# EAGLE schematic REVAr-HW_v0.0 (EAGLE 9.1.0)

## Sheet 1 of 2
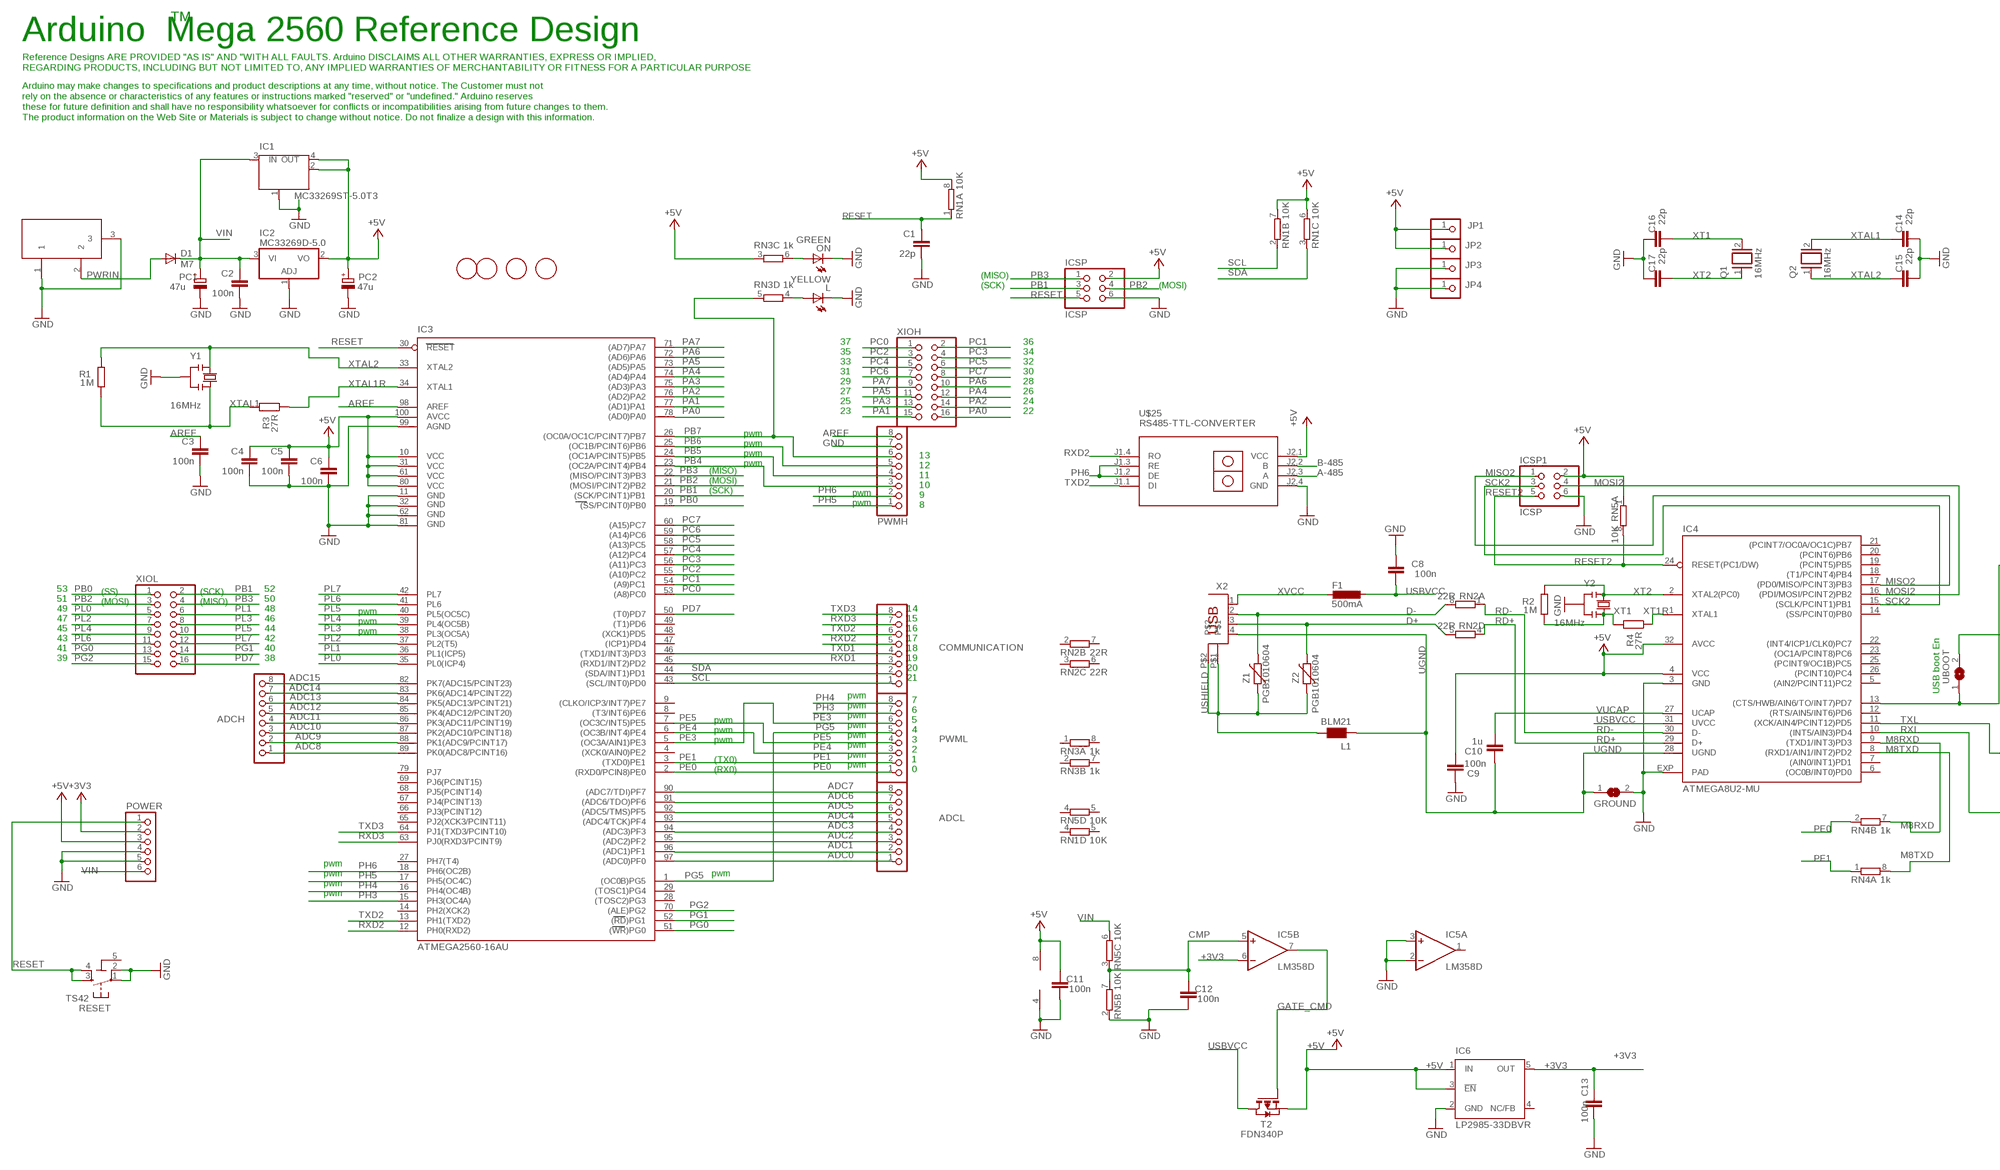
[diagram p0: schematic, sheet 1, part 1 of 2]
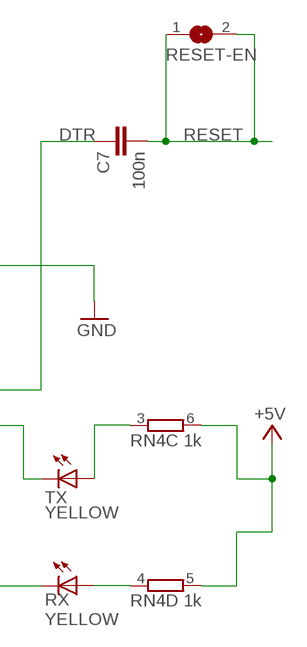
[diagram p1: schematic, sheet 1, part 2 of 2]

### Parts
ADCH  PINHD-1X8  [1X08]
ADCL  PINHD-1X8  [1X08]
C1  22p  C-EU0603-RND  [C0603-ROUND]
C2  100n  C-EU0603-RND  [C0603-ROUND]
C3  100n  C-EU0603-RND  [C0603-ROUND]
C4  100n  C-EU0603-RND  [C0603-ROUND]
C5  100n  C-EU0603-RND  [C0603-ROUND]
C6  100n  C-EU0603-RND  [C0603-ROUND]
C7  100n  C-EU0603-RND  [C0603-ROUND]
C8  100n  C-EUC0603  [C0603]
C9  100n  C-EU0603-RND  [C0603-ROUND]
C10  1u  C-EU0603-RND  [C0603-ROUND]
C11  100n  C-EUC0603  [C0603]
C12  100n  C-EU0603-RND  [C0603-ROUND]
C13  100n  C-EU0603-RND  [C0603-ROUND]
C14  22p  C-EU0603-RND  [C0603-ROUND]
C15  22p  C-EU0603-RND  [C0603-ROUND]
C16  22p  C-EU0603-RND  [C0603-ROUND]
C17  22p  C-EU0603-RND  [C0603-ROUND]
COMMUNICATION  PINHD-1X8  [1X08]
D1  M7  DIODE-SMB  [SMB]
F1  500mA  L-EUL1812  [L1812]
GROUND  SJ  [SJ]
IC1  MC33269ST-5.0T3  MC33269ST-3.3T3  [SOT223]
IC2  MC33269D-5.0  [DPACK]
IC3  ATMEGA2560-16AU  ATMEGA1280-16AU  [TQFP100]
IC4  ATMEGA8U2-MU  [QFN32]
IC5  LM358D  [SO08]
IC6  LP2985-33DBVR  TPS77033  [SOT23-DBV]
ICSP  ICSP  PINHD-2X3  [2X03]
ICSP1  ICSP  PINHD-2X3  [2X03]
JP1  PINHD-1X1  [1X01]
JP2  PINHD-1X1  [1X01]
JP3  PINHD-1X1  [1X01]
JP4  PINHD-1X1  [1X01]
L  YELLOW  LEDCHIP-LED0805  [CHIP-LED0805]
L1  BLM21  WE-CBF_0805  [0805]
ON  GREEN  LEDCHIP-LED0805  [CHIP-LED0805]
PC1  47u  CPOL-EUD  [PANASONIC_D]
PC2  47u  CPOL-EUD  [PANASONIC_D]
POWER  PINHD-1X6  [1X06]
PWMH  PINHD-1X8  [1X08]
PWML  PINHD-1X8  [1X08]
Q1  16MHz  XTAL/S  [QS]
Q2  16MHz  XTAL/S  [QS]
R1  1M  R-EU_R0603  [R0603-ROUND]
R2  1M  R-EU_R0603  [R0603-ROUND]
R3  27R  R-EU_R0603  [R0603-ROUND]
R4  27R  R-EU_R0603  [R0603-ROUND]
RESET  TS42  [TS42]
RESET-EN  SJ  [SJ]
RN1  10K  4R-NCAT16  [CAT16]
RN2  22R  4R-NCAY16  [CAY16]
RN3  1k  4R-NCAY16  [CAY16]
RN4  1k  4R-NCAY16  [CAY16]
RN5  10K  4R-NCAT16  [CAT16]
RX  YELLOW  LEDCHIP-LED0805  [CHIP-LED0805]
T2  FDN340P  PMOSSOT23  [SOT-23]
TX  YELLOW  LEDCHIP-LED0805  [CHIP-LED0805]
U$2  FIDUCIALMOUNT  [FIDUCIA-MOUNT]
U$3  FIDUCIALMOUNT  [FIDUCIA-MOUNT]
U$4  FIDUCIALMOUNT  [FIDUCIA-MOUNT]
U$5  FIDUCIALMOUNT  [FIDUCIA-MOUNT]
U$25  RS485-TTL-CONVERTER  [RS485-TTL-CONVERTER]
UBOOT  SJ  [SJ]
X1  DC21MMX  [DC-21MM]
X2  PN61729  [PN61729]
XIOH  PINHD-2X8  [2X08]
XIOL  PINHD-2X8  [2X08]
Y1  16MHz  RESONATORMU  [RESONATOR]
Y2  16MHz  RESONATORMU  [RESONATOR]
Z1  PGB1010604  VARISTORCN0603  [CT/CN0603]
Z2  PGB1010604  VARISTORCN0603  [CT/CN0603]

### Nets
+3V3: C13.2 IC5.6(B:-IN) IC6.5(OUT) POWER.2
+5V: C4.1 C5.1 C6.1 C9.1 C11.2 IC1.2(OUT) IC1.4(OUT) IC2.2(VO) IC3.10(VCC) IC3.31(VCC1) IC3.61(VCC2) IC3.80(VCC3) IC3.100(AVCC) IC4.4(VCC) IC4.32(AVCC) IC5.8(P:V+) IC6.1(IN) IC6.3(!EN) ICSP1.2 ICSP.2 JP1.1 JP2.1 PC2.+ POWER.3 RN1.6 RN1.7 RN1.8 RN3.3 RN4.5 RN4.6 RN5.1 T2.2(S) ; also sheet 2
A-485: U$25.J2.3(A) ; also sheet 2
ADC0: ADCL.1 IC3.97((ADC0)PF0)
ADC1: ADCL.2 IC3.96((ADC1)PF1)
ADC2: ADCL.3 IC3.95((ADC2)PF2)
ADC3: ADCL.4 IC3.94((ADC3)PF3)
ADC4: ADCL.5 IC3.93((ADC4/TCK)PF4)
ADC5: ADCL.6 IC3.92((ADC5/TMS)PF5)
ADC6: ADCL.7 IC3.91((ADC6/TDO)PF6)
ADC7: ADCL.8 IC3.90((ADC7/TDI)PF7)
ADC8: ADCH.1 IC3.89(PK0(ADC8/PCINT16))
ADC9: ADCH.2 IC3.88(PK1(ADC9/PCINT17))
ADC10: ADCH.3 IC3.87(PK2(ADC10/PCINT18))
ADC11: ADCH.4 IC3.86(PK3(ADC11/PCINT19))
ADC12: ADCH.5 IC3.85(PK4(ADC12/PCINT20))
ADC13: ADCH.6 IC3.84(PK5(ADC13/PCINT21))
ADC14: ADCH.7 IC3.83(PK6(ADC14/PCINT22))
ADC15: ADCH.8 IC3.82(PK7(ADC15/PCINT23))
AREF: C3.1 IC3.98(AREF) PWMH.8
B-485: U$25.J2.2(B) ; also sheet 2
CMP: C12.2 IC5.5(B:+IN) RN5.3 RN5.7
D+: RN2.5 X2.3 Z2.2
D-: RN2.8 X2.2 Z1.2
DTR: C7.1 IC4.13((CTS/HWB/AIN6/TO/INT7)PD7) UBOOT.1
GATE_CMD: IC5.7(B:OUT) T2.3(G)
GND: C1.2 C2.2 C3.2 C4.2 C5.2 C6.2 C8.2 C9.2 C11.1 C12.1 C13.1 C14.1 C15.1 C16.2 C17.2 GROUND.2 IC1.1(GND/ADJ) IC2.1(ADJ) IC3.11(GND) IC3.32(GND1) IC3.62(GND2) IC3.81(GND3) IC3.99(AGND) IC4.3(GND) IC4.EXP(PAD) IC5.2(A:-IN) IC5.3(A:+IN) IC5.4(P:V-) IC6.2(GND) ICSP1.6 ICSP.6 JP3.1 JP4.1 L.C ON.C PC1.- PC2.- POWER.4 POWER.5 PWMH.7 RESET.1 RESET.2 RN5.2 U$25.J2.4(GND) UBOOT.2 X1.1 X1.3 Y1.2 Y2.2 ; also sheet 2
M8RXD: IC4.9((TXD1/INT3)PD3) RN4.7
M8TXD: IC4.8((RXD1/AIN1/INT2)PD2) RN4.8
MISO2: IC4.17((PD0/MISO/PCINT3)PB3) ICSP1.1
MOSI2: IC4.16((PDI/MOSI/PCINT2)PB2) ICSP1.4
N$2: L.A RN3.4
N$3: ON.A RN3.6
N$54: RN4.4 RX.A
N$55: RN4.3 TX.A
PA0: IC3.78((AD0)PA0) XIOH.16
PA1: IC3.77((AD1)PA1) XIOH.15
PA2: IC3.76((AD2)PA2) XIOH.14
PA3: IC3.75((AD3)PA3) XIOH.13
PA4: IC3.74((AD4)PA4) XIOH.12
PA5: IC3.73((AD5)PA5) XIOH.11
PA6: IC3.72((AD6)PA6) XIOH.10
PA7: IC3.71((AD7)PA7) XIOH.9
PB0: IC3.19((SS/PCINT0)PB0) XIOL.1
PB1: IC3.20((SCK/PCINT1)PB1) ICSP.3 XIOL.2 ; also sheet 2
PB2: IC3.21((MOSI/PCINT2)PB2) ICSP.4 XIOL.3 ; also sheet 2
PB3: IC3.22((MISO/PCINT3)PB3) ICSP.1 XIOL.4 ; also sheet 2
PB4: IC3.23((OC2A/PCINT4)PB4) PWMH.3 ; also sheet 2
PB5: IC3.24((OC1A/PCINT5)PB5) PWMH.4 ; also sheet 2
PB6: IC3.25((OC1B/PCINT6)PB6) PWMH.5 ; also sheet 2
PB7: IC3.26((OC0A/OC1C/PCINT7)PB7) PWMH.6 RN3.5 ; also sheet 2
PC0: IC3.53((A8)PC0) XIOH.1
PC1: IC3.54((A9)PC1) XIOH.2
PC2: IC3.55((A10)PC2) XIOH.3
PC3: IC3.56((A11)PC3) XIOH.4
PC4: IC3.57((A12)PC4) XIOH.5
PC5: IC3.58((A13)PC5) XIOH.6
PC6: IC3.59((A14)PC6) XIOH.7
PC7: IC3.60((A15)PC7) XIOH.8
PD7: IC3.50((T0)PD7) XIOL.16
PE0: IC3.2((RXD0/PCIN8)PE0) PWML.1 RN4.2
PE1: IC3.3((TXD0)PE1) PWML.2 RN4.1
PE3: IC3.5((OC3A/AIN1)PE3) PWML.6 ; also sheet 2
PE4: IC3.6((OC3B/INT4)PE4) PWML.3 ; also sheet 2
PE5: IC3.7((OC3C/INT5)PE5) PWML.4 ; also sheet 2
PG0: IC3.51((WR)PG0) XIOL.13
PG1: IC3.52((RD)PG1) XIOL.14
PG2: IC3.70((ALE)PG2) XIOL.15
PG5: IC3.1((OC0B)PG5) PWML.5 ; also sheet 2
PH3: IC3.15(PH3(OC4A)) PWML.7 ; also sheet 2
PH4: IC3.16(PH4(OC4B)) PWML.8 ; also sheet 2
PH5: IC3.17(PH5(OC4C)) PWMH.1 ; also sheet 2
PH6: IC3.18(PH6(OC2B)) PWMH.2 U$25.J1.2(DE) U$25.J1.3(RE)
PL0: IC3.35(PL0(ICP4)) XIOL.5
PL1: IC3.36(PL1(ICP5)) XIOL.6
PL2: IC3.37(PL2(T5)) XIOL.7
PL3: IC3.38(PL3(OC5A)) XIOL.8
PL4: IC3.39(PL4(OC5B)) XIOL.9
PL5: IC3.40(PL5(OC5C)) XIOL.10
PL6: IC3.41(PL6) XIOL.11
PL7: IC3.42(PL7) XIOL.12
PWRIN: D1.A X1.2
RD+: IC4.29(D+) RN2.4
RD-: IC4.30(D-) RN2.1
RESET: C1.1 C7.2 IC3.30(RESET) ICSP.5 POWER.1 RESET-EN.1 RESET-EN.2 RESET.3 RESET.4 RN1.1
RESET2: IC4.24(RESET(PC1/DW)) ICSP1.5 RN5.8
RXD1: COMMUNICATION.3 IC3.45((RXD1/INT2)PD2) ; also sheet 2
RXD2: COMMUNICATION.5 IC3.12(PH0(RXD2)) U$25.J1.4(RO)
RXD3: COMMUNICATION.7 IC3.63(PJ0(RXD3/PCINT9))
RXL: IC4.10((INT5/AIN3)PD4) RX.C
SCK2: IC4.15((SCLK/PCINT1)PB1) ICSP1.3
SCL: COMMUNICATION.1 IC3.43((SCL/INT0)PD0) RN1.2 ; also sheet 2
SDA: COMMUNICATION.2 IC3.44((SDA/INT1)PD1) RN1.3 ; also sheet 2
TXD1: COMMUNICATION.4 IC3.46((TXD1/INT3)PD3) ; also sheet 2
TXD2: COMMUNICATION.6 IC3.13(PH1(TXD2)) U$25.J1.1(DI)
TXD3: COMMUNICATION.8 IC3.64(PJ1(TXD3/PCINT10))
TXL: IC4.11((XCK/AIN4/PCINT12)PD5) TX.C
UGND: C10.2 GROUND.1 IC4.28(UGND) L1.1 X2.4
USBVCC: C8.1 F1.1 IC4.31(UVCC) T2.1(D)
USHIELD: L1.2 X2.P$1 X2.P$2 Z1.1 Z2.1
VCC: U$25.J2.1(VCC) ; supply symbol labelled +5V ; also sheet 2
VIN: C2.1 D1.C IC1.3(IN) IC2.3(VI) PC1.+ POWER.6 RN5.6
VUCAP: C10.1 IC4.27(UCAP)
XT1: C16.1 Q1.2 R2.1 R4.2 Y2.3
XT1R: IC4.1(XTAL1) R4.1
XT2: C17.1 IC4.2(XTAL2(PC0)) Q1.1 R2.2 Y2.1
XTAL1: C14.2 Q2.2 R1.1 R3.2 Y1.3
XTAL1R: IC3.34(XTAL1) R3.1
XTAL2: C15.2 IC3.33(XTAL2) Q2.1 R1.2 Y1.1
XVCC: F1.2 X2.1
Unconnected: IC3.4((XCK0/AIN0)PE2) IC3.8((T3/INT6)PE6) IC3.9((CLKO/ICP3/INT7)PE7) IC3.14(PH2(XCK2)) IC3.27(PH7(T4)) IC3.28((TOSC2)PG3) IC3.29((TOSC1)PG4) IC3.47((ICP1)PD4) IC3.48((XCK1)PD5) IC3.49((T1)PD6) IC3.65(PJ2(XCK3/PCINT11)) IC3.66(PJ3(PCINT12)) IC3.67(PJ4(PCINT13)) IC3.68(PJ5(PCINT14)) IC3.69(PJ6(PCINT15)) IC3.79(PJ7) IC4.5((AIN2/PCINT11)PC2) IC4.6((OC0B/INT0)PD0) IC4.7((AIN0/INT1)PD1) IC4.12((RTS/AIN5/INT6)PD6) IC4.14((SS/PCINT0)PB0) IC4.18((T1/PCINT4)PB4) IC4.19((PCINT5)PB5) IC4.20((PCINT6)PB6) IC4.21((PCINT7/OC0A/OC1C)PB7) IC4.22((INT4/ICP1/CLK0)PC7) IC4.23((OC1A/PCINT8)PC6) IC4.25((PCINT9/OC1B)PC5) IC4.26((PCINT10)PC4) IC5.1(A:OUT) IC6.4(NC/FB) RN1.4 RN1.5 RN2.2 RN2.3 RN2.6 RN2.7 RN3.1 RN3.2 RN3.7 RN3.8 RN5.4 RN5.5

### Notes on the sheet
- TM
- Arduino  Mega 2560 Reference Design
- Reference Designs ARE PROVIDED "AS IS" AND "WITH ALL FAULTS. Arduino DISCLAIMS ALL OTHER WARRANTIES, EXPRESS OR IMPLIED,
  REGARDING PRODUCTS, INCLUDING BUT NOT LIMITED TO, ANY IMPLIED WARRANTIES OF MERCHANTABILITY OR FITNESS FOR A PARTICULAR PURPOSE
- Arduino may make changes to specifications and product descriptions at any time, without notice. The Customer must not
  rely on the absence or characteristics of any features or instructions marked "reserved" or "undefined." Arduino reserves
  these for future definition and shall have no responsibility whatsoever for conflicts or incompatibilities arising from future changes to them.
  The product information on the Web Site or Materials is subject to change without notice. Do not finalize a design with this information.
- (MISO)
- (SCK) | (MOSI)
- 37 | 36
- 35 | 34
- 33 | 32
- 31 | 30
- 29 | 28
- 27 | 26
- 25 | 24
- 23 | 22
- pwm
- pwm
- pwm | 13
- pwm | 12
- (MISO)
- 11
- (MOSI)
- 10
- (SCK) | pwm
- 9
- pwm | 8
- 53 | (SS) | (SCK) | 52
- 51 | (MOSI) | (MISO) | 50
- 49 | 48 | pwm | 14
- 47 | 46 | pwm | 15
- 45 | 44 | pwm | 16
- 43 | 42 | 17
- 41 | 40 | 18
- 39 | 38 | 19
- 20
- 21
- USB boot En
- pwm
- 7
- pwm
- 6
- pwm
- pwm | 5
- pwm
- pwm | 4
- pwm
- pwm | 3
- pwm
- 2
- pwm
- (TX0) | 1
- pwm
- (RX0) | 0
- pwm
- pwm | pwm
- pwm
- pwm

## Sheet 2 of 2
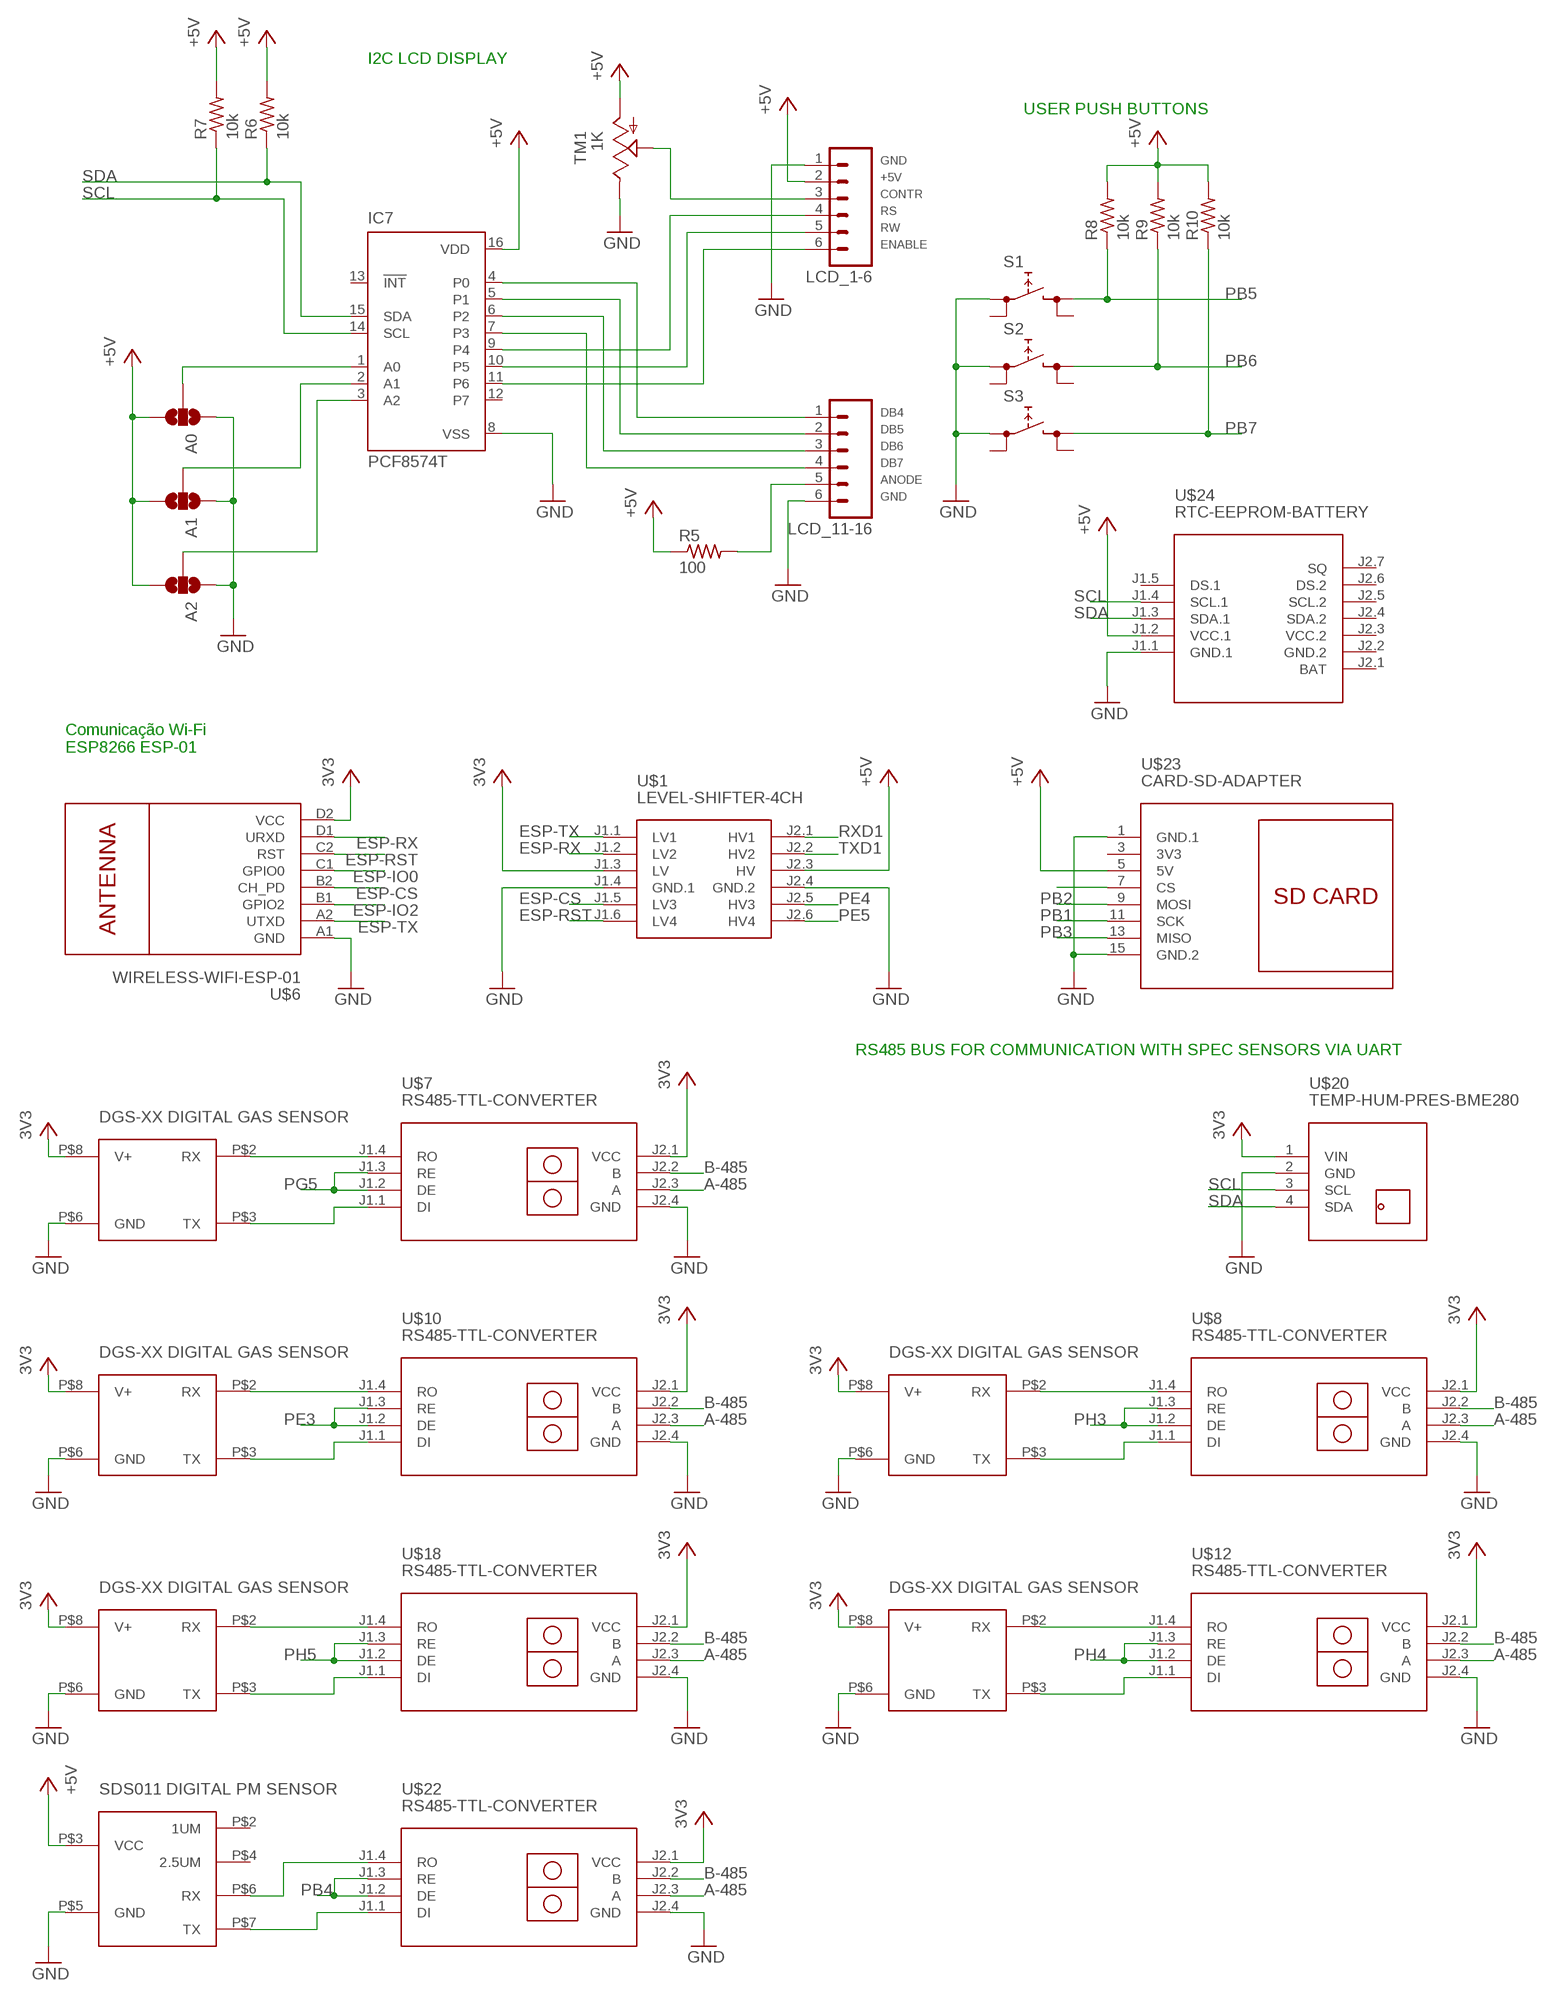
[diagram p2: schematic, sheet 2]

### Parts
A0  SOLDERJUMPER_2WAYT  [SJ_2]
A1  SOLDERJUMPER_2WAYT  [SJ_2]
A2  SOLDERJUMPER_2WAYT  [SJ_2]
IC7  PCF8574T  [SO16W]
LCD_1-6  M06SIP  [1X06]
LCD_11-16  M06SIP  [1X06]
R5  100  R-US_R0805  [R0805]
R6  10k  R-US_R0805  [R0805]
R7  10k  R-US_R0805  [R0805]
R8  10k  R-US_R0805  [R0805]
R9  10k  R-US_R0805  [R0805]
R10  10k  R-US_R0805  [R0805]
S1  REKN  [REKN]
S2  REKN  [REKN]
S3  REKN  [REKN]
TM1  1K  TRIM  [6MM]
U$1  LEVEL-SHIFTER-4CH  [LEVEL-SHIFTER-4CH]
U$6  WIRELESS-WIFI-ESP-01  [WIRELESS-WIFI-ESP-01]
U$7  RS485-TTL-CONVERTER  [RS485-TTL-CONVERTER]
U$8  RS485-TTL-CONVERTER  [RS485-TTL-CONVERTER]
U$9  DGS-XX  [DGS-XX]
U$10  RS485-TTL-CONVERTER  [RS485-TTL-CONVERTER]
U$11  DGS-XX  [DGS-XX]
U$12  RS485-TTL-CONVERTER  [RS485-TTL-CONVERTER]
U$16  DGS-XX  [DGS-XX]
U$17  DGS-XX  [DGS-XX]
U$18  RS485-TTL-CONVERTER  [RS485-TTL-CONVERTER]
U$19  DGS-XX  [DGS-XX]
U$20  TEMP-HUM-PRES-BME280  [TEMP-HUM-PRES-BME280]
U$21  SDS011  [SDS011]
U$22  RS485-TTL-CONVERTER  [RS485-TTL-CONVERTER]
U$23  CARD-SD-ADAPTER  [CARD-SD-ADAPTER]
U$24  RTC-EEPROM-BATTERY  [RTC-EEPROM-BATTERY]

### Nets
+5V: LCD_1-6.2 ; also sheet 1
A0: A0.2 IC7.1(A0)
A1: A1.2 IC7.2(A1)
A2: A2.2 IC7.3(A2)
A-485: U$7.J2.3(A) U$8.J2.3(A) U$10.J2.3(A) U$12.J2.3(A) U$18.J2.3(A) U$22.J2.3(A) ; also sheet 1
ANODE: LCD_11-16.5 R5.2
B-485: U$7.J2.2(B) U$8.J2.2(B) U$10.J2.2(B) U$12.J2.2(B) U$18.J2.2(B) U$22.J2.2(B) ; also sheet 1
CONTR: LCD_1-6.3 TM1.S
DB4: IC7.4(P0) LCD_11-16.1
DB5: IC7.5(P1) LCD_11-16.2
DB6: IC7.6(P2) LCD_11-16.3
DB7: IC7.7(P3) LCD_11-16.4
ENABLE: IC7.11(P6) LCD_1-6.6
ESP-CS: U$1.J1.5(LV3) U$6.B2(CH_PD)
ESP-IO0: U$6.C1(GPIO0)
ESP-IO2: U$6.B1(GPIO2)
ESP-RST: U$1.J1.6(LV4) U$6.C2(RST)
ESP-RX: U$1.J1.2(LV2) U$6.D1(URXD)
ESP-TX: U$1.J1.1(LV1) U$6.A2(UTXD)
GND: A0.1 A1.1 A2.1 IC7.8(VSS) LCD_1-6.1 LCD_11-16.6 S1.0A S2.0A S3.0A TM1.E U$1.J1.4(GND.1) U$1.J2.4(GND.2) U$6.A1(GND) U$7.J2.4(GND) U$8.J2.4(GND) U$9.P$6(GND) U$10.J2.4(GND) U$11.P$6(GND) U$12.J2.4(GND) U$16.P$6(GND) U$17.P$6(GND) U$18.J2.4(GND) U$19.P$6(GND) U$20.2(GND) U$21.P$5(GND) U$22.J2.4(GND) U$23.1(GND.1) U$23.15(GND.2) U$24.J1.1(GND.1) ; also sheet 1
N$1: U$7.J1.4(RO) U$16.P$2(RX)
N$4: U$7.J1.1(DI) U$16.P$3(TX)
N$5: U$10.J1.4(RO) U$11.P$2(RX)
N$6: U$10.J1.1(DI) U$11.P$3(TX)
N$7: U$18.J1.4(RO) U$19.P$2(RX)
N$8: U$8.J1.1(DI) U$9.P$3(TX)
N$9: U$18.J1.1(DI) U$19.P$3(TX)
N$10: U$12.J1.4(RO) U$17.P$2(RX)
N$11: U$8.J1.4(RO) U$9.P$2(RX)
N$12: U$12.J1.1(DI) U$17.P$3(TX)
N$13: U$21.P$6(RX) U$22.J1.4(RO)
N$14: U$21.P$7(TX) U$22.J1.1(DI)
N$18: U$23.7(CS)
PB1: U$23.11(SCK) ; also sheet 1
PB2: U$23.9(MOSI) ; also sheet 1
PB3: U$23.13(MISO) ; also sheet 1
PB4: U$22.J1.2(DE) U$22.J1.3(RE) ; also sheet 1
PB5: R8.1 S1.1A ; also sheet 1
PB6: R9.1 S2.1A ; also sheet 1
PB7: R10.1 S3.1A ; also sheet 1
PE3: U$10.J1.2(DE) U$10.J1.3(RE) ; also sheet 1
PE4: U$1.J2.5(HV3) ; also sheet 1
PE5: U$1.J2.6(HV4) ; also sheet 1
PG5: U$7.J1.2(DE) U$7.J1.3(RE) ; also sheet 1
PH3: U$8.J1.2(DE) U$8.J1.3(RE) ; also sheet 1
PH4: U$12.J1.2(DE) U$12.J1.3(RE) ; also sheet 1
PH5: U$18.J1.2(DE) U$18.J1.3(RE) ; also sheet 1
RS: IC7.9(P4) LCD_1-6.4
RW: IC7.10(P5) LCD_1-6.5
RXD1: U$1.J2.1(HV1) ; also sheet 1
SCL: IC7.14(SCL) R7.1 U$20.3(SCL) U$24.J1.4(SCL.1) ; also sheet 1
SDA: IC7.15(SDA) R6.1 U$20.4(SDA) U$24.J1.3(SDA.1) ; also sheet 1
TXD1: U$1.J2.2(HV2) ; also sheet 1
VCC: A0.3 A1.3 A2.3 IC7.16(VDD) R5.1 R6.2 R7.2 R8.2 R9.2 R10.2 TM1.A U$1.J1.3(LV) U$1.J2.3(HV) U$6.D2(VCC) U$7.J2.1(VCC) U$8.J2.1(VCC) U$9.P$8(V+) U$10.J2.1(VCC) U$11.P$8(V+) U$12.J2.1(VCC) U$16.P$8(V+) U$17.P$8(V+) U$18.J2.1(VCC) U$19.P$8(V+) U$20.1(VIN) U$21.P$3(VCC) U$22.J2.1(VCC) U$23.5(5V) U$24.J1.2(VCC.1) ; supply symbol labelled 3V3, +5V ; also sheet 1
Unconnected: IC7.12(P7) IC7.13(!INT) S1.0B S1.1B S2.0B S2.1B S3.0B S3.1B U$21.P$2(1UM) U$21.P$4(2.5UM) U$24.J1.5(DS.1) U$24.J2.1(BAT) U$24.J2.4(SDA.2) U$24.J2.5(SCL.2) U$24.J2.6(DS.2) U$24.J2.7(SQ)

### Notes on the sheet
- I2C LCD DISPLAY
- USER PUSH BUTTONS
- Comunicação Wi-Fi
  ESP8266 ESP-01
- RS485 BUS FOR COMMUNICATION WITH SPEC SENSORS VIA UART

## Power pins joined to a net without a drawn wire
3V3: U$23.3(3V3)
5-GND: RESET.5(5-GND)
GND.2: U$24.J2.2(GND.2)
VCC.2: U$24.J2.3(VCC.2)

## Library data of the parts
A0 A1 A2 = SparkFun:SOLDERJUMPER_2WAY: Solder Jumper 2 way solder jumper
ADCH ADCL COMMUNICATION PWMH PWML = pinhead:PINHD-1X8: PIN HEADER
C1-C7 C9 C10 C12-C17 = SmartPrj:C-EU: CAPACITOR, European symbol
C8 C11 = rcl:C-EU: CAPACITOR, European symbol
D1 = diode:DIODE-: DIODE
F1 = rcl:L-EU: INDUCTOR, European symbol
GROUND RESET-EN UBOOT = jumper:SJ: SMD solder JUMPER
IC1 = linear:MC33269ST*: Adjustable Output Low Dropout Voltage Regulator 800 mA Source: http://www.onsemi.com/pub/Collateral/MC33269-D.PDF
IC2 = linear:MC33269?*: Adjustable Output Low Dropout Voltage Regulator 800 mA Source: http://www.onsemi.com/pub/Collateral/MC33269-D.PDF
IC3 = atmel-2005:ATMEGA*: MICROCONTROLLER 64/128/256 Kbytes FLASH 4 Kbytes EEPROM 8 Kbytes SRAM 86 General Purpose I/O pins 12-channels16-bit PWM 4 x Serial USARTs 16-channels 10-bit A/D
IC4 = atmel:ATMEGA8U2-MU
IC5 = linear:LM358: OP AMP also LM158; LM258; LM2904 Source: http://cache.national.com/ds/LM/LM158.pdf
IC6 = texas:TPS770*: ULTRALOW-POWER 50-mA LOW-DROPOUT LINEAR REGULATORS 50-mA Low-Dropout Regulator Source: http://focus.ti.com/lit/ds/symlink/tps77001.pdf
IC7 = micro-philips:PCF8574: I2C-Bus Remote 8-bit I/O expander http://www.semiconductors.philips.com/acrobat_download/datasheets/PCF8574_4.pdf; MPN: PCF8574T/3,512; OC_FARNELL: 1201255; OC_NEWARK: 70R6870
ICSP ICSP1 = pinhead:PINHD-2X3: PIN HEADER
JP1-JP4 = pinhead:PINHD-1X1: PIN HEADER
L ON RX TX = led:LED: LED OSRAM: - CHIPLED LG R971, LG N971, LY N971, LG Q971, LY Q971, LO R971, LY R971 LH N974, LH R974 LS Q976, LO Q976, LY Q976 LO Q996 - Hyper CHIPLED LW Q18S LB Q993, LB Q99A, LB R99A - SideLED LS A670, LO A670, LY A670, LG A670, LP A670 LB A673, LV A673, LT A673, LW A673 LH A674 LY A675 LS A676, LA A676, LO A676, LY A676, LW A676 LS A679, LY A679, LG A679 - Hyper Micro SIDELED® LS Y876, LA Y876, LO Y876, LY Y876 LT Y87S - SmartLED LW L88C, LW L88S LB L89C, LB L89S, LG L890 LS L89K, LO L89K, LY L89K LS L896, LA L896, LO L896, LY L896 - TOPLED LS T670, LO T670, LY T670, LG T670, LP T670 LSG T670, LSP T670, LSY T670, LOP T670, LYG T670 LG T671, LOG T671, LSG T671 LB T673, LV T673, LT T673, LW T673 LH T674 LS T676, LA T676, LO T676, LY T676, LB T676, LH T676, LSB T676, LW T676 LB T67C, LV T67C, LT T67C, LS T67K, LO T67K, LY T67K, LW E67C LS E67B, LA E67B, LO E67B, LY E67B, LB E67C, LV E67C, LT E67C LW T67C LS T679, LY T679, LG T679 LS T770, LO T770, LY T770, LG T770, LP T770 LB T773, LV T773, LT T773, LW T773 LH T774 LS E675, LA E675, LY E675, LS T675 LS T776, LA T776, LO T776, LY T776, LB T776 LHGB T686 LT T68C, LB T68C - Hyper Mini TOPLED® LB M676 - Mini TOPLED Santana® LG M470 LS M47K, LO M47K, LY M47K Source: http://www.osram.convergy.de LUXEON: - LUMILED® LXK2-PW12-R00, LXK2-PW12-S00, LXK2-PW14-U00, LXK2-PW14-V00 LXK2-PM12-R00, LXK2-PM12-S00, LXK2-PM14-U00 LXK2-PE12-Q00, LXK2-PE12-R00, LXK2-PE12-S00, LXK2-PE14-T00, LXK2-PE14-U00 LXK2-PB12-K00, LXK2-PB12-L00, LXK2-PB12-M00, LXK2-PB14-N00, LXK2-PB14-P00, LXK2-PB14-Q00 LXK2-PR12-L00, LXK2-PR12-M00, LXK2-PR14-Q00, LXK2-PR14-R00 LXK2-PD12-Q00, LXK2-PD12-R00, LXK2-PD12-S00 LXK2-PH12-R00, LXK2-PH12-S00 LXK2-PL12-P00, LXK2-PL12-Q00, LXK2-PL12-R00 Source: www.luxeon.com KINGBRIGHT: KA-3528ASYC Source: www.kingbright.com
L1 = wuerth-elektronik:WE-CBF: SMD EMI Suppression Ferrite Beads - excellent anti-EMI properties - low DCR - impedances till 3000 ohms - rated current up to 6 A
LCD_1-6 LCD_11-16 = SparkFun-Connectors:M06: Header 6 Standard 6-pin 0.1" header. Use with straight break away headers (SKU : PRT-00116), right angle break away headers (PRT-00553), swiss pins (PRT-00743), machine pins (PRT-00117), and female headers (PRT-00115). Molex polarized connector foot print use with SKU : PRT-08094 with associated crimp pins and housings. NOTES ON THE VARIANTS LOCK and LOCK_LONGPADS... This footprint was designed to help hold the alignment of a through-hole component (i.e. 6-pin header) while soldering it into place. You may notice that each hole has been shifted either up or down by 0.005 of an inch from it's more standard position (which is a perfectly straight line). This slight alteration caused the pins (the squares in the middle) to touch the edges of the holes. Because they are alternating, it causes a "brace" to hold the component in place. 0.005 has proven to be the perfect amount of "off-center" position when using our standard breakaway headers. Although looks a little odd when you look at the bare footprint, once you have a header in there, the alteration is very hard to notice. Also, if you push a header all the way into place, it is covered up entirely on the bottom side. This idea of altering the position of holes to aid alignment will be further integrated into the Sparkfun Library for other footprints. It can help hold any component with 3 or more connection pins.
PC1 PC2 = rcl:CPOL-EU: POLARIZED CAPACITOR, European symbol
POWER = pinhead:PINHD-1X6: PIN HEADER
Q1 Q2 = special:XTAL/S: CRYSTAL
R1-R4 = SmartPrj:R-EU_: RESISTOR, European symbol
R5-R10 = adafruit:R-US_: RESISTOR, American symbol
RESET = st-mod v1.4:TS42: TS42 Dongnan Electronics Tact switch VDC 12V - 50mA
RN1-RN5 = resistor-dil:4R-N: Array Chip Resistor Source: RS Component / Phycomp
S1-S3 = switch:REKN: PUSH SWITCH ITT-Cannon-Cannon
T2 = zetex:PMOSSOT23: MOS FET
TM1 = adafruit:TRIM
U$1 = diy-modules:LEVEL-SHIFTER-4CH: 4-Channel Bi-Directional Logic Level Converter based on BSS128 transistors Click here to find device on ebay.com <http://www.ebay.com/sch/i2c+logic+converter+module>
U$2-U$5 = SmartPrj:FIDUCIALMOUNT
U$6 = diy-modules:WIRELESS-WIFI-ESP-01: Wireless Wi-Fi ESP-01 Module based on ESP8266 chip Click here to find device on ebay.com <http://www.ebay.com/sch/esp8266+esp+01+transceiver>
U$7 U$8 U$10 U$12 U$18 U$22 U$25 = diy-modules:RS485-TTL-CONVERTER: RS485 to TTL converter based on MAX485 chip
U$9 U$11 U$16 U$17 U$19 = spec-sensors:DGS-XX: SPEC Gas Sensor for the Internet of Things
U$20 = diy-modules:TEMP-HUM-PRES-BME280: Digital Humidity-Temperature-Pressure Sensor based on BME280 device More information about BME280 device is available here: https://www.bosch-sensortec.com/bst/products/all_products/bme280 Click here to find device on ebay.com <http://www.ebay.com/sch/bme280+breakout>
U$21 = gas-sensors:SDS011: NOVA FITNESS Laser PM UART SENSOR
U$23 = diy-modules:CARD-SD-ADAPTER: Full Size SD Card Adapter Module with onboard 3.3V regulator Guide describing how to use SD card with Arduino is available here: https://www.arduino.cc/en/Reference/SDCardNotes Click here to find device on ebay.com <http://www.ebay.com/sch/sd+card+socket+module>
U$24 = diy-modules:RTC-EEPROM-BATTERY: RTC Module with Battery and EEPROM based on DS1307 and AT24C32 chips More details available here: http://henrysbench.capnfatz.com/henrys-bench/arduino-sensors-and-input/arduino-tiny-rtc-d1307-tutorial/ Click here to find device on ebay.com <http://www.ebay.com/sch/tiny+rtc+arduino>
X1 = powersupply:DC21MM
X2 = SmartPrj:PN61729: BERG USB connector
XIOH XIOL = pinhead:PINHD-2X8: PIN HEADER
Y1 Y2 = SmartPrj:RESONATOR
Z1 Z2 = varistor:VARISTOR: VARISTOR

## Net classes
0 default: width 0.15 mm, drill 0.3 mm, clearance 0.15 mm